# EasyEDA Pro project ProPrj_555 Circuit_2025-11-02.epro

# Schematic Schematic1
Board Name: PCB2; Create Date: 2025-11-01; Page Name: P1; Project Name: 555 Circuit; Schematic Name: Schematic1; Update Date: 2025-11-01; Company: EasyEDA.com; Page Size: A4; Version: V1.0
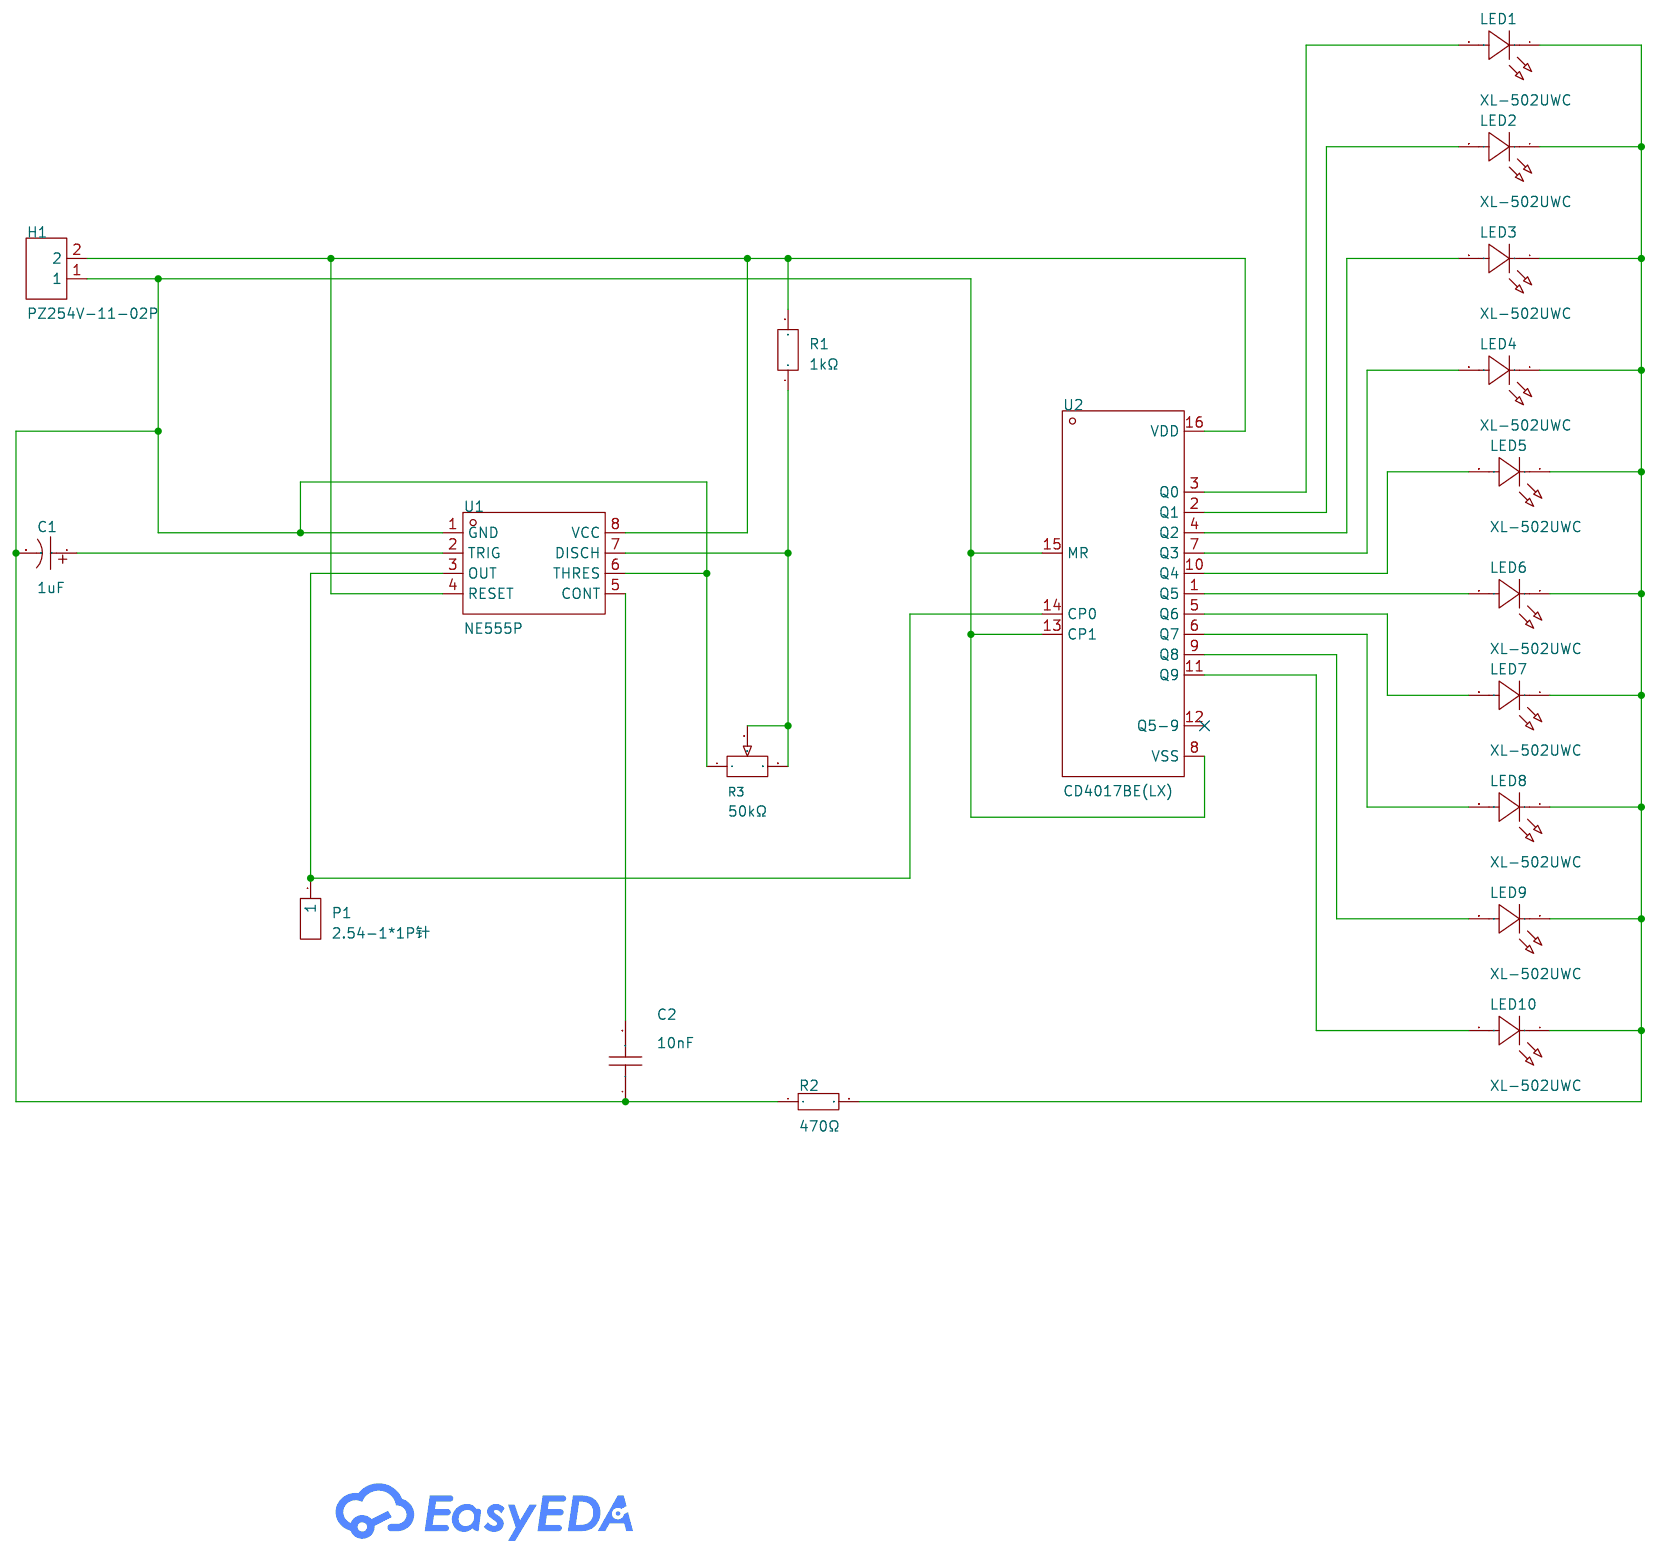
[diagram p0: schematic sheet]

## Parts
C1  1uF  [CAP-TH_BD5.0-P2.00-D0.8-FD]
C2  10nF  [CAP-TH_L8.0-W4.0-P5.00-D1.2]
H1  PZ254V-11-02P  [HDR-TH_2P-P2.54-V-M]
LED1  XL-502UWC  [LED-TH_BD5.9-P2.54-RD_WHITE]
LED2  XL-502UWC  [LED-TH_BD5.9-P2.54-RD_WHITE]
LED3  XL-502UWC  [LED-TH_BD5.9-P2.54-RD_WHITE]
LED4  XL-502UWC  [LED-TH_BD5.9-P2.54-RD_WHITE]
LED5  XL-502UWC  [LED-TH_BD5.9-P2.54-RD_WHITE]
LED6  XL-502UWC  [LED-TH_BD5.9-P2.54-RD_WHITE]
LED7  XL-502UWC  [LED-TH_BD5.9-P2.54-RD_WHITE]
LED8  XL-502UWC  [LED-TH_BD5.9-P2.54-RD_WHITE]
LED9  XL-502UWC  [LED-TH_BD5.9-P2.54-RD_WHITE]
LED10  XL-502UWC  [LED-TH_BD5.9-P2.54-RD_WHITE]
P1  2.54-1*1P针  [HDR-TH_1P-P2.54-V-M]
R1  1kΩ  [RES-TH_BD2.3-L6.5-P10.50-D0.5]
R2  470Ω  [RES-TH_BD2.2-L6.5-P10.50-D0.6]
R3  50kΩ  [RES-ADJ-TH_3P-L9.5-W4.85-P2.50-BL-L]
U1  NE555P  [DIP-8_L9.8-W6.6-P2.54-LS7.6-BL]
U2  CD4017BE(LX)  [PDIP-16_L19.3-W6.4-P2.54-LS7.94-BL]

## Library data of the parts
C1 = KF010M050C110A: Capacitance:1uF Tolerance:±20% Tolerance:±20% Voltage Rating:50V Pin Spacing:2mm Diameter:5mm Height - Seated (Max):11mm Lifetime:2000hrs@105℃; LCSC Part Name: 1uF ±20% 50V; Supplier Part: C62934; Manufacturer: CapXon(丰宾); Supplier Footprint: 插件,D5xL11mm; Datasheet: https://item.szlcsc.com/datasheet/KF010M050C110A/63997.html; Supplier: LCSC; Tolerance: ±20%; Voltage Rating: 50V; Pin Spacing: 2mm; Diameter: 5mm; Height - Seated (Max): 11mm; Lifetime: 2000hrs@105℃
C2 = N09F1B103MN0B0S0N0: Capacitance:10nF Tolerance:±20% Tolerance:±20% Voltage Rating:1kV Pin Spacing:5mm Temperature Coefficient:Y5V Diameter:8.5mm Body Thickness:2.5mm; LCSC Part Name: 10nF ±20% 1kV; Supplier Part: C249157; Manufacturer: STE(松田); Supplier Footprint: 插件,P=5mm; Datasheet: https://item.szlcsc.com/datasheet/N09F1B103MN0B0S0N0/245516.html; Supplier: LCSC; Tolerance: ±20%; Voltage Rating: 1kV; Pin Spacing: 5mm; Temperature Coefficient: Y5V; Diameter: 8.5mm; Body Thickness: 2.5mm
H1 = PZ254V-11-02P: Pin Structure:1x2P Pitch:2.54mm Row Spacing:- Circluar Pins/Square Pins:Pin Header Mounting Type:Through Hole Number of Rows:1 Number of Pins:2P Current Rating:- Voltage Rating (Max):- Length of Mating Pin:6mm Insulation Height:2.5mm Length of End Connect; LCSC Part Name: 1x2P 间距:2.54mm 方针 直插; Supplier Part: C492401; Manufacturer: XFCN(兴飞); Supplier Footprint: 插件,P=2.54mm; Datasheet: https://item.szlcsc.com/datasheet/PZ254V-11-02P/502957.html; Supplier: LCSC; Pin Structure: 1x2P; Pitch: 2.54mm; Circluar Pins/Square Pins: Pin Header; Mounting Type: Through Hole; Number of Rows: 1; Number of Pins: 2P; Length of Mating Pin: 6mm; Insulation Height: 2.5mm; Length of End Connection Pin: 3mm; Contact Material: Brass; Operating Temperature: -40℃~+105℃; Color: Black
LED1-LED10 = XL-502UWC: Lamp Holder Type:5mm Round Lens Illumination Color:White Voltage - Forward(Vf):3.3V Voltage - Forward(Vf):3.3V Power(Watts):70mW Forward Current:20mA Lens Color:Water Clear Color Temperature:9000K~20000K Color Temperature:9000K~20000K Luminous Intensity:2; LCSC Part Name: F5白发白短脚; Supplier Part: C2895480; Manufacturer: XINGLIGHT(成兴光); Supplier Footprint: 插件,D=5mm; JLCPCB Part Class: Extended Part; Datasheet: https://item.szlcsc.com/datasheet/XL-502UWC/3136195.html; Supplier: LCSC; Lamp Holder Type: 5mm Round Lens; Illumination Color: White; Voltage - Forward(Vf): 3.3V; Power(Watts): 70mW; Forward Current: 20mA; Lens Color: Water Clear; Color Temperature: 9000K~20000K; Luminous Intensity: 20000mcd; Viewing Angle: 30°; Operating Temperature: -25℃~+85℃
P1 = 2.54-1*1P针: Pin Structure:- Pitch:- Row Spacing:- Circluar Pins/Square Pins:Pin Header Mounting Type:Through Hole Number of Rows:1 Number of Pins:1P Current Rating:3A Voltage Rating (Max):- Length of Mating Pin:6mm Insulation Height:2.5mm Length of End Connection Pin; LCSC Part Name: 方针 直插; Supplier Part: C81276; Manufacturer: BOOMELE(博穆精密); Supplier Footprint: 插件,P=2.54mm; Datasheet: https://item.szlcsc.com/datasheet/2.54-1*1P%25E9%2592%2588/82426.html; Supplier: LCSC; Circluar Pins/Square Pins: Pin Header; Mounting Type: Through Hole; Number of Rows: 1; Number of Pins: 1P; Current Rating: 3A; Length of Mating Pin: 6mm; Insulation Height: 2.5mm; Length of End Connection Pin: 3mm; Contact Material: Brass; Contact Plating: Gold; Operating Temperature: -55℃~+105℃; Color: Black
R1 = MF1/4W-1KΩ±1%T52: Type:Metal Film Resistors Resistance: Tolerance:±1% Tolerance:±1% Power(Watts):250mW Temperature Coefficient:±200ppm/℃ Temperature Coefficient:±200ppm/℃; LCSC Part Name: 金属膜电阻 1kΩ ±1% 250mW; Supplier Part: C713997; Manufacturer: 华星机电; Supplier Footprint: 插件,D2.3xL6.5mm; Datasheet: https://atta.szlcsc.com/upload/public/pdf/source/20200731/C713882_AE8EB1102749D7E4FB4FB13DC898C429.pdf; Supplier: LCSC; Type: Metal Film Resistors; Tolerance: ±1%; Power(Watts): 250mW; Temperature Coefficient: ±200ppm/℃
R2 = MFR0W4F4700A50: Type:Metal Film Resistors Resistance: Tolerance:±1% Tolerance:±1% Voltage-Supply(Max):250V Power(Watts):250mW Temperature Coefficient:±50ppm/℃ Temperature Coefficient:±50ppm/℃; LCSC Part Name: 470Ω ±1% 250mW 金属膜电阻 铜脚，圆柱状直插; Supplier Part: C58592; Manufacturer: UNI-ROYAL(厚声); Supplier Footprint: 插件,D2.2xL6.5mm; Datasheet: https://atta.szlcsc.com/upload/public/pdf/source/20191012/C436293_8820AA14BC71FA35E551C06C441482A0.pdf; Supplier: LCSC; Type: Metal Film Resistors; Tolerance: ±1%; Voltage-Supply(Max): 250V; Power(Watts): 250mW; Temperature Coefficient: ±50ppm/℃
R3 = 3296X-1-503_C118912: Resistance:50kΩ Tolerance:±10% Tolerance:±10% Power(Watts):500mW Temperature Coefficient:±250ppm/℃ Temperature Coefficient:±250ppm/℃ Number of Turns:30; LCSC Part Name: 50kΩ ±10%; Supplier Part: C118912; Manufacturer: BOCHEN(博晨); Manufacturer Part: 3296X-1-503; Supplier Footprint: 插件-3P,9.5x4.9mm; Datasheet: https://item.szlcsc.com/datasheet/3296X-1-503/120181.html; Supplier: LCSC; Tolerance: ±10%; Power(Watts): 500mW; Temperature Coefficient: ±250ppm/℃; Number of Turns: 30
U1 = NE555P: Supplier Part: C46749; Manufacturer: TI(德州仪器); Supplier Footprint: DIP-8; JLCPCB Part Class: Extended Part; Datasheet: https://www.ti.com/cn/lit/gpn/ne555; Supplier: LCSC
U2 = CD4017BE(LX): Logic Type:Divide-by-10 Direction:Up Counter Voltage - Supply:3V~15V Voltage - Supply:3V~15V Number of Elements:1 Trigger Type:Rising Edge Reset:Asynchronous Count Rate:11MHz Operating Temperature:-40℃~+85℃ Operating Temperature:-40℃~+85℃; Supplier Part: C32710674; Manufacturer: LX(灵星芯微); Supplier Footprint: DIP-16; JLCPCB Part Class: Extended Part; Datasheet: https://atta.szlcsc.com/upload/public/pdf/source/20240723/A05E41C3796D239DF5E274CF6ACDBDA1.pdf; Supplier: LCSC; Logic Type: Divide-by-10; Direction: Up Counter; Voltage - Supply: 3V~15V; Number of Elements: 1; Trigger Type: Rising Edge; Reset: Asynchronous; Count Rate: 11MHz; Operating Temperature: -40℃~+85℃

## Nets
$1N1253: LED1.2(A) U2.3(Q0)
$1N1276: LED2.2(A) U2.2(Q1)
$1N1285: LED3.2(A) U2.4(Q2)
$1N1292: LED4.2(A) U2.7(Q3)
$1N1302: LED5.2(A) U2.10(Q4)
$1N1312: LED6.2(A) U2.1(Q5)
$1N1318: LED7.2(A) U2.5(Q6)
$1N1328: LED8.2(A) U2.6(Q7)
$1N1340: LED9.2(A) U2.9(Q8)
$1N1352: LED10.2(A) U2.11(Q9)
$1N1411: H1.2 R1.2 U1.4(RESET) U1.8(VCC) U2.16(VDD)
$1N1417: LED1.1(K) LED2.1(K) LED3.1(K) LED4.1(K) LED5.1(K) LED6.1(K) LED7.1(K) LED8.1(K) LED9.1(K) LED10.1(K) R2.2
$1N1628: C1.2 C2.1 H1.1 R2.1 R3.1 U1.1(GND) U1.6(THRES) U2.8(VSS) U2.13(CP1) U2.15(MR)
$1N1749: C1.1 U1.2(TRIG)
$1N1755: P1.1 U1.3(OUT) U2.14(CP0)
$1N1879: C2.2 U1.5(CONT)
$1N1885: R1.1 R3.2 R3.3 U1.7(DISCH)

Not connected (* = marked no-connect by the designer): U2 12(Q5-9)*

# Board PCB3
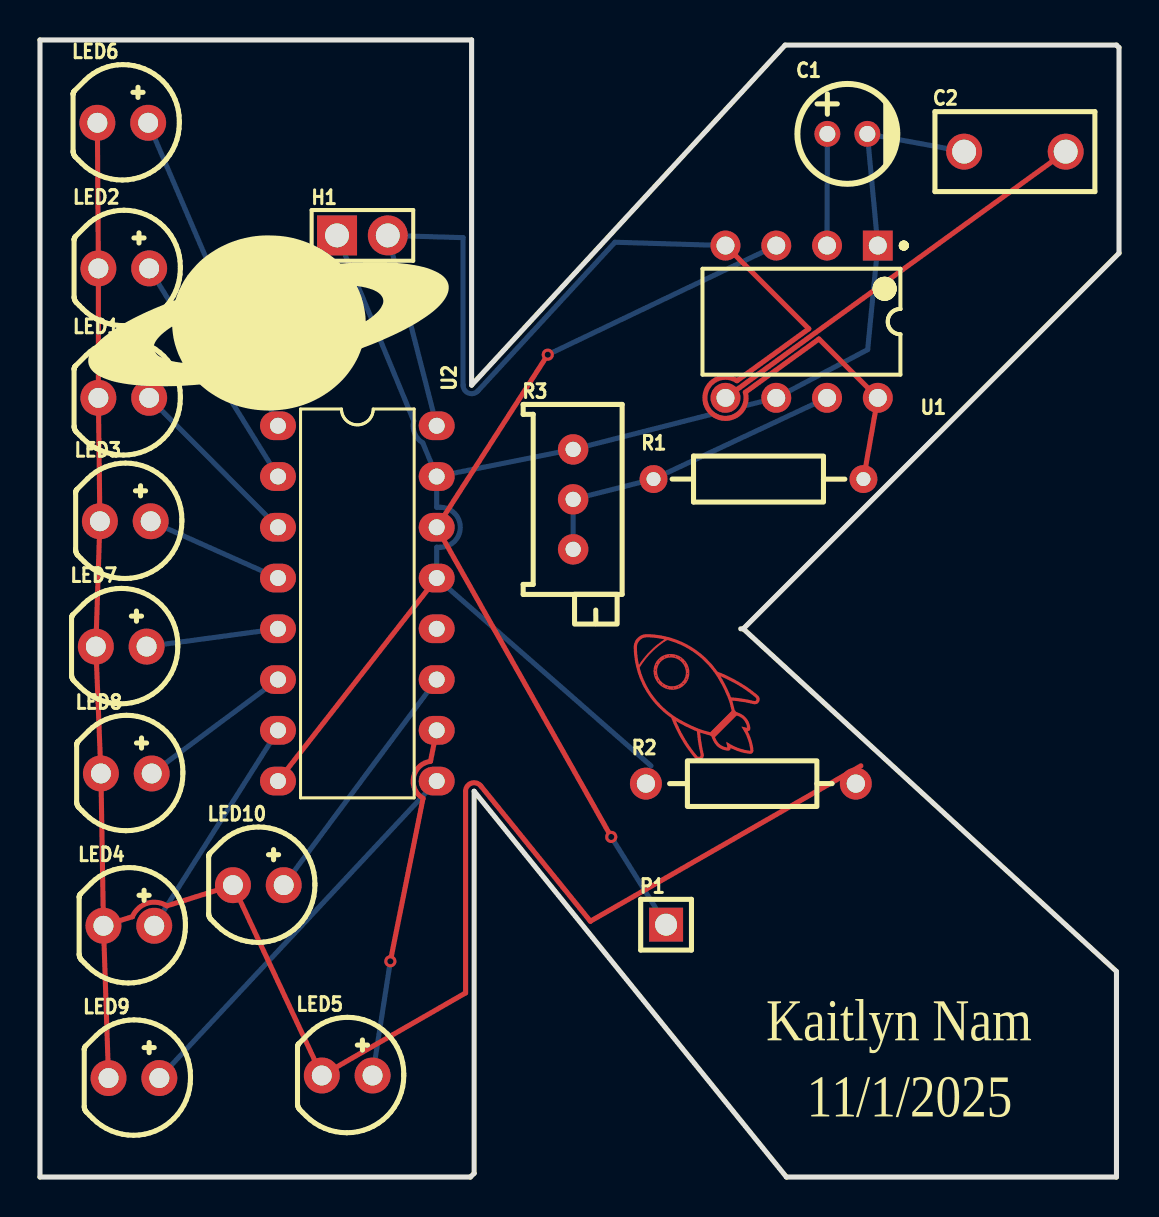
[diagram p1: board, top side]
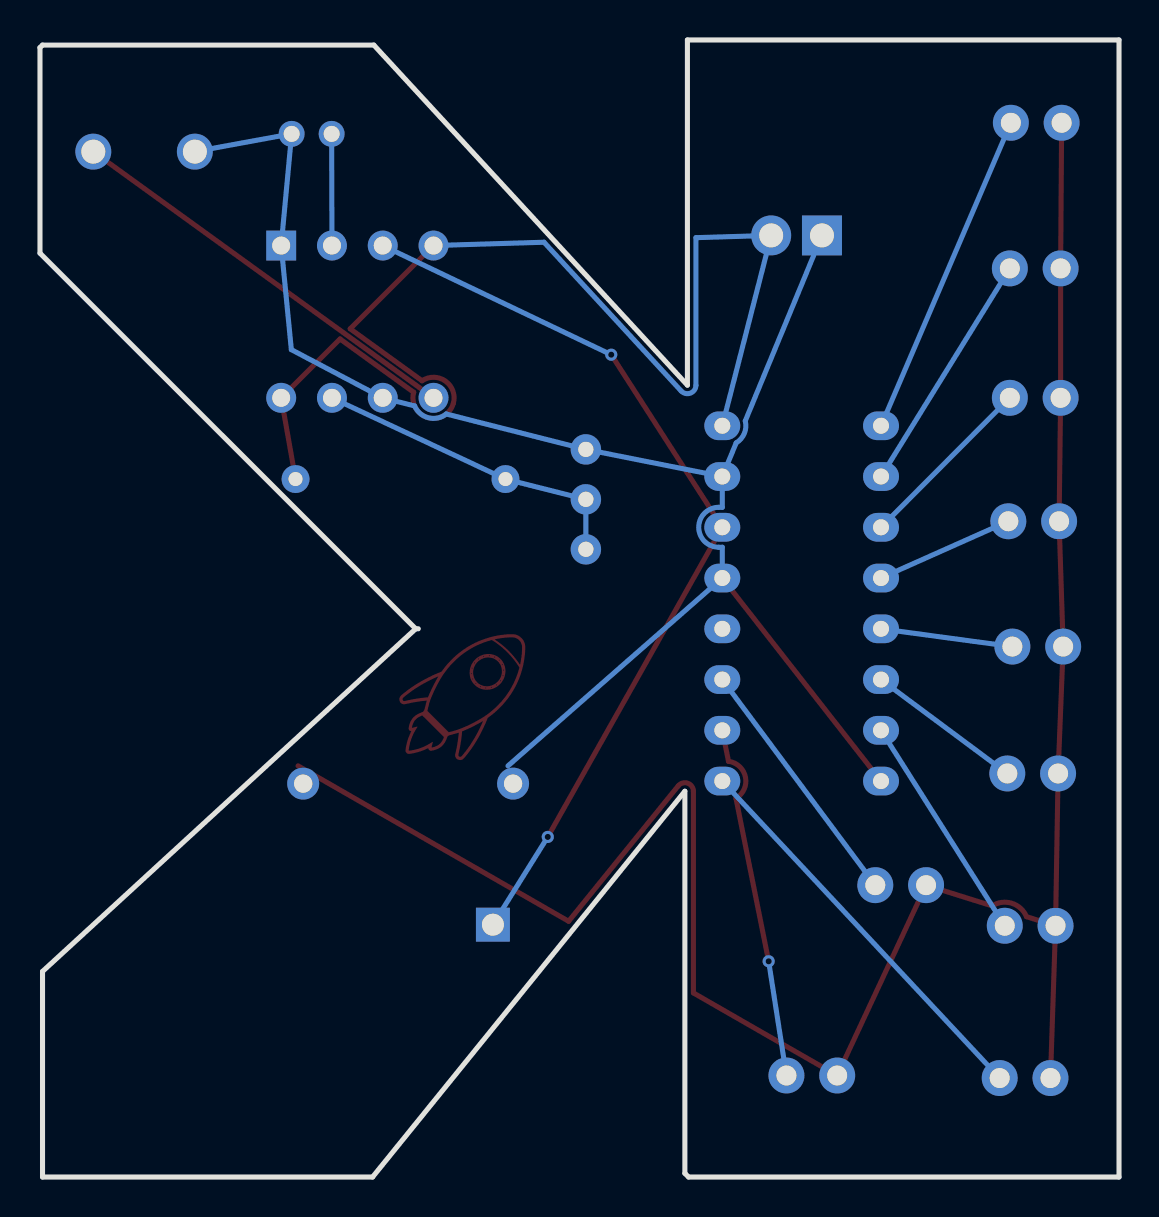
[diagram p2: board, bottom side, seen from below]

Outline 53.98 x 56.9 mm; copper layers: Top Layer, Bottom Layer. Coordinates in mm from the lower left corner of the outline.
Outline path: 35.18,27.43 35.05,27.43 ; 35.18,27.43 53.85,10.29 53.85,0 37.34,0 21.72,19.3 21.72,0.19 21.53,0 0,0 0,56.9 21.59,56.9 21.59,39.62 37.27,56.64 53.85,56.64 53.98,56.51 53.98,46.23 35.18,27.43
Stack: Top Layer 0.035mm / Dielectric1 1.51mm FR4 er 4.5 / Bottom Layer 0.035mm

## Design rules (mm)
template: JLCPCB Capability(Two Layers Board)
spacing copperThickness1oz (default): track to track 0.102, other pairs 0.152 to 0.3
spacing copperThickness2oz: track to track 0.203, other pairs 0.152 to 0.3
track width copperThickness1oz (default): min 0.127, default 0.254, max 2.54
track width copperThickness2oz: min 0.203, default 0.254, max 2.54
differential pair differentialPair (default): width min 0.127, default 0.254, max 2.54; gap min 0.152, default 0.152
via viaSize (default): diameter min 0.5, default 0.61, max 10; hole min 0.3, default 0.305, max 6.3

## Placement (name value [footprint] x y rotation side)
C1  1uF  [CAP-TH_BD5.0-P2.00-D0.8-FD]  40.39 52.2 0 top
C2  10nF  [CAP-TH_L8.0-W4.0-P5.00-D1.2]  48.77 51.31 0 top
H1  PZ254V-11-02P  [HDR-TH_2P-P2.54-V-M]  16.13 47.12 0 top
LED1  XL-502UWC  [LED-TH_BD5.9-P2.54-RD_WHITE]  4.19 38.99 0 top
LED2  XL-502UWC  [LED-TH_BD5.9-P2.54-RD_WHITE]  4.19 45.47 0 top
LED3  XL-502UWC  [LED-TH_BD5.9-P2.54-RD_WHITE]  4.27 32.81 0 top
LED4  XL-502UWC  [LED-TH_BD5.9-P2.54-RD_WHITE]  4.44 12.57 0 top
LED5  XL-502UWC  [LED-TH_BD5.9-P2.54-RD_WHITE]  15.37 5.08 0 top
LED6  XL-502UWC  [LED-TH_BD5.9-P2.54-RD_WHITE]  4.14 52.75 0 top
LED7  XL-502UWC  [LED-TH_BD5.9-P2.54-RD_WHITE]  4.06 26.54 0 top
LED8  XL-502UWC  [LED-TH_BD5.9-P2.54-RD_WHITE]  4.32 20.19 0 top
LED9  XL-502UWC  [LED-TH_BD5.9-P2.54-RD_WHITE]  4.7 4.95 0 top
LED10  XL-502UWC  [LED-TH_BD5.9-P2.54-RD_WHITE]  10.92 14.6 0 top
P1  2.54-1*1P针  [HDR-TH_1P-P2.54-V-M]  31.32 12.63 0 top
R1  1kΩ  [RES-TH_BD2.3-L6.5-P10.50-D0.5]  35.94 34.92 0 top
R2  470Ω  [RES-TH_BD2.2-L6.5-P10.50-D0.6]  35.56 19.68 0 top
R3  50kΩ  [RES-ADJ-TH_3P-L9.5-W4.85-P2.50-BL-L]  26.67 33.91 0 top
U1  NE555P  [DIP-8_L9.8-W6.6-P2.54-LS7.6-BL]  38.1 42.8 180 top
U2  CD4017BE(LX)  [PDIP-16_L19.3-W6.4-P2.54-LS7.94-BL]  15.87 28.7 270 top

## Footprints (pads in the part's own frame, mm; a bottom-side part is the same pattern mirrored in y, then rotated)
CAP-TH_BD5.0-P2.00-D0.8-FD
  round 1.3 hole 0.8: 1(-1,0) 2(1,0)
CAP-TH_L8.0-W4.0-P5.00-D1.2
  round 1.8 hole 1.2: 1(-2.54,0) 2(2.54,0)
DIP-8_L9.8-W6.6-P2.54-LS7.6-BL
  rect 1.5x1.5 hole 0.9: 1(-3.81,-3.81)
  round 1.5 hole 0.9: 2(-1.27,-3.81) 3(1.27,-3.81) 4(3.81,-3.81) 5(3.81,3.81) 6(1.27,3.81) 7(-1.27,3.81) 8(-3.81,3.81)
HDR-TH_1P-P2.54-V-M
  rect 1.7x1.7 hole 1.1: 1(0,0)
HDR-TH_2P-P2.54-V-M
  rect 2x2 hole 1.2: 1(-1.27,0)
  round 2 hole 1.2: 2(1.27,0)
LED-TH_BD5.9-P2.54-RD_WHITE
  round 1.8 hole 1: 1(-1.27,0) 2(1.27,0)
PDIP-16_L19.3-W6.4-P2.54-LS7.94-BL
  oval 1.44x1.8 hole 0.8: 1(-8.89,-3.97) 2(-6.35,-3.97) 3(-3.81,-3.97) 4(-1.27,-3.97) 5(1.27,-3.97) 6(3.81,-3.97) 7(6.35,-3.97) 8(8.89,-3.97) 9(8.89,3.97) 10(6.35,3.97) 11(3.81,3.97) 12(1.27,3.97) 13(-1.27,3.97) 14(-3.81,3.97) 15(-6.35,3.97) 16(-8.89,3.97)
RES-ADJ-TH_3P-L9.5-W4.85-P2.50-BL-L
  round 1.524 hole 0.762: 1(0,2.5) 2(0,0) 3(0,-2.5)
RES-TH_BD2.2-L6.5-P10.50-D0.6
  round 1.6 hole 0.914: 1(-5.25,0) 2(5.25,0)
RES-TH_BD2.3-L6.5-P10.50-D0.5
  round 1.4 hole 0.7: 1(-5.25,0) 2(5.25,0)

## Nets
As in the schematic.

Pads without a net: U2 12

## Via types
v1: diameter 0.61, hole 0.305, Top Layer to Bottom Layer, 3 vias

## Routing (per net, layer and track width the routed paths; a pad name or vN(x,y) marks a point on that pad's centre or on a via; arc(x,y) is an arc through that point)
$1N1253: length 9.1
  Bottom Layer w0.254: LED1.2 U2.3
$1N1276: length 12.2
  Bottom Layer w0.254: LED2.2 U2.2
$1N1285: length 7
  Bottom Layer w0.254: LED3.2 U2.4
$1N1292: length 11.6
  Bottom Layer w0.254: 5.72,12.57 U2.7
$1N1302: length 18.2
  Top Layer w0.254: v1(17.53,10.79) 19.16,18.95 arc(18.69,20.01) 19.53,20.8 U2.10
  Bottom Layer w0.254: 16.64,5.08 v1(17.53,10.79)
$1N1312: length 16.5
  Bottom Layer w0.254: LED6.2 U2.1
$1N1318: length 6.6
  Bottom Layer w0.254: LED7.2 U2.5
$1N1328: length 7.9
  Bottom Layer w0.254: LED8.2 U2.6
$1N1340: length 20.3
  Bottom Layer w0.254: LED9.2 U2.9
$1N1352: length 12.8
  Bottom Layer w0.254: LED10.2 U2.11
$1N1411: length 66.6
  Top Layer w0.254: R1.2 U1.8 38.96,41.93 35.28,39.27 arc(34.57,38) 33.3,38.71 arc(33.69,39.82) 34.86,39.84 38.46,42.44 U1.4
  Bottom Layer w0.254: U2.16 H1.2 21.16,47 21.16,39.62 arc(21.43,39.23) 21.9,39.33 28.76,46.77 U1.4
$1N1417: length 109.1
  Top Layer w0.254: LED4.1 4.63,13.03 arc(5.36,13.7) 6.35,13.57 LED10.1 LED5.1 21.29,9.21 21.29,19.3 arc(21.57,19.71) 22.05,19.57 27.53,12.8 41.06,20.57 ; LED4.1 LED8.1 LED7.1 LED3.1 2.92,38.99 2.92,45.47 LED6.1 ; LED4.1 LED9.1
$1N1628: length 85.5
  Top Layer w0.254: U2.8 U2.13
  Bottom Layer w0.254: H1.1 18.7,37.83 arc(18.74,37.21) 19.15,36.74 U2.15 ; U2.15 R3.1 33.65,38.18 arc(34.54,37.99) 35.24,38.58 U1.6 41.4,41.4 U1.1 C1.2 C2.1 ; U2.15 19.84,33.51 20.02,33.51 arc(21.02,32.51) 20.02,31.51 19.84,31.51 U2.13 30.56,20.57
$1N1749: length 5.6
  Bottom Layer w0.254: C1.1 U1.2
$1N1755: length 45.9
  Top Layer w0.254: v1(25.4,41.15) U2.14 v1(28.58,17.02)
  Bottom Layer w0.254: U1.3 v1(25.4,41.15) ; v1(28.58,17.02) P1.1
$1N1879: length 21
  Top Layer w0.254: C2.2 U1.5
$1N1885: length 16.2
  Bottom Layer w0.254: R3.3 R3.2 R1.1 U1.7

Small or netless copper shapes (teardrops, artwork), in the pictures only: 2 on Top Layer

## Text on the board
Top Silkscreen Layer: Kaitlyn Nam | 11/1/2025
